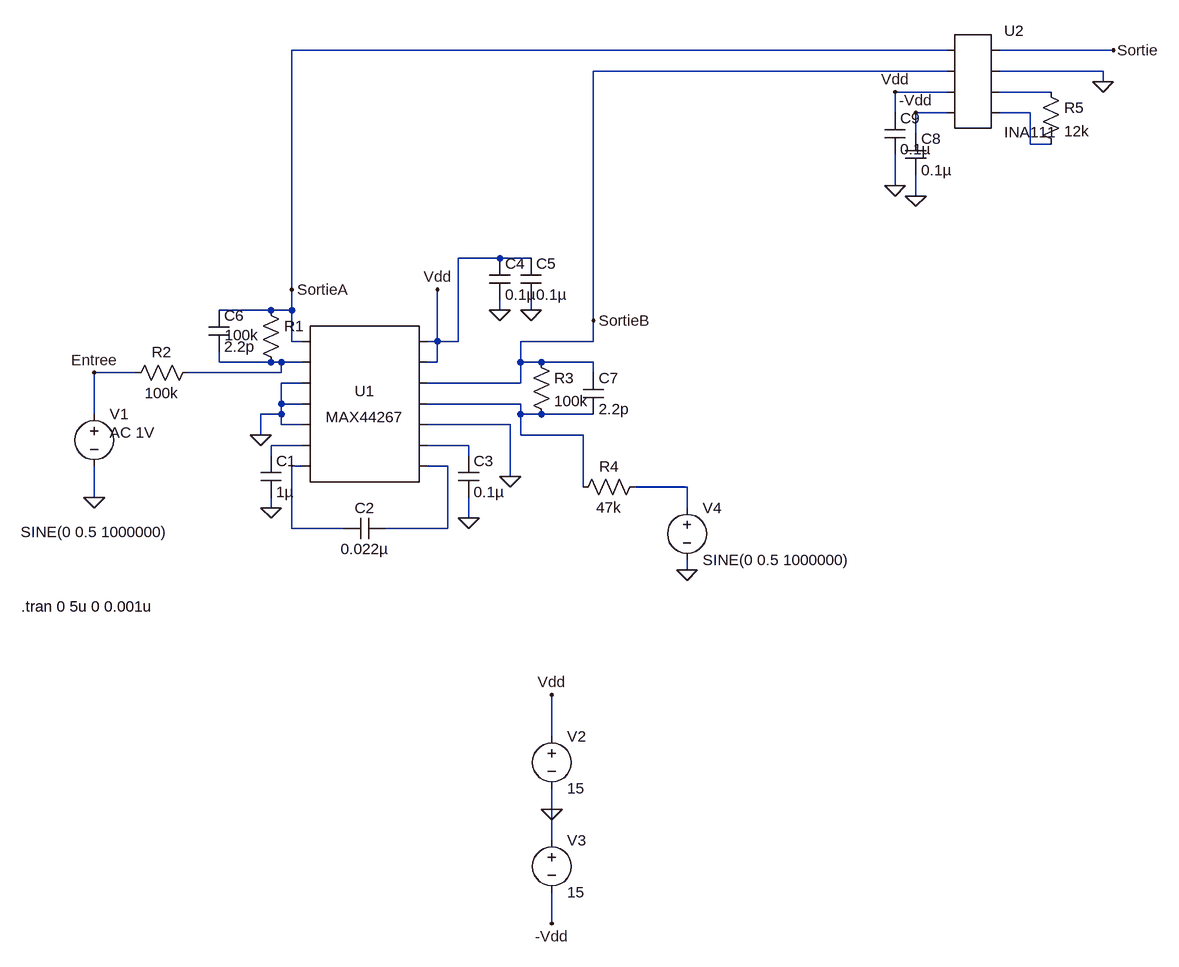
[diagram p0: schematic Chain d'acquisition.asc]
Chain d'acquisition.asc, the LTspice schematic file:
Version 4
SHEET 1 880 1332
WIRE -1456 -112 -2464 -112
WIRE -1200 -112 -1376 -112
WIRE -1456 -80 -2000 -80
WIRE -1216 -80 -1376 -80
WIRE -1216 -64 -1216 -80
WIRE -1456 -48 -1536 -48
WIRE -1296 -48 -1376 -48
WIRE -1536 -16 -1536 -48
WIRE -1456 -16 -1504 -16
WIRE -1328 -16 -1376 -16
WIRE -1504 16 -1504 -16
WIRE -1328 32 -1328 -16
WIRE -1296 32 -1328 32
WIRE -1536 96 -1536 48
WIRE -1504 112 -1504 80
WIRE -2144 208 -2208 208
WIRE -2096 208 -2144 208
WIRE -2464 256 -2464 -112
WIRE -2496 288 -2576 288
WIRE -2464 288 -2464 256
WIRE -2464 288 -2496 288
WIRE -2144 288 -2144 272
WIRE -2096 288 -2096 272
WIRE -2000 304 -2000 -80
WIRE -2464 336 -2464 288
WIRE -2448 336 -2464 336
WIRE -2240 336 -2240 256
WIRE -2240 336 -2256 336
WIRE -2208 336 -2208 208
WIRE -2208 336 -2240 336
WIRE -2000 336 -2000 304
WIRE -2000 336 -2112 336
WIRE -2576 368 -2576 352
WIRE -2496 368 -2576 368
WIRE -2480 368 -2496 368
WIRE -2448 368 -2480 368
WIRE -2240 368 -2240 336
WIRE -2240 368 -2256 368
WIRE -2112 368 -2112 336
WIRE -2080 368 -2112 368
WIRE -2000 368 -2080 368
WIRE -2704 384 -2768 384
WIRE -2480 384 -2480 368
WIRE -2480 384 -2624 384
WIRE -2000 384 -2000 368
WIRE -2448 400 -2480 400
WIRE -2112 400 -2112 368
WIRE -2112 400 -2256 400
WIRE -2480 432 -2480 400
WIRE -2448 432 -2480 432
WIRE -2112 432 -2256 432
WIRE -2768 448 -2768 384
WIRE -2480 448 -2480 432
WIRE -2480 448 -2512 448
WIRE -2112 448 -2112 432
WIRE -2080 448 -2112 448
WIRE -2000 448 -2080 448
WIRE -2480 464 -2480 448
WIRE -2448 464 -2480 464
WIRE -2128 464 -2256 464
WIRE -2512 480 -2512 448
WIRE -2112 480 -2112 448
WIRE -2016 480 -2112 480
WIRE -2448 496 -2496 496
WIRE -2192 496 -2256 496
WIRE -2496 512 -2496 496
WIRE -2192 512 -2192 496
WIRE -2448 528 -2464 528
WIRE -2224 528 -2256 528
WIRE -2128 544 -2128 464
WIRE -2016 560 -2016 480
WIRE -1856 560 -1936 560
WIRE -2768 576 -2768 528
WIRE -2496 592 -2496 576
WIRE -1856 592 -1856 560
WIRE -2192 608 -2192 576
WIRE -2464 624 -2464 528
WIRE -2384 624 -2464 624
WIRE -2224 624 -2224 528
WIRE -2224 624 -2320 624
WIRE -1856 688 -1856 672
WIRE -2064 944 -2064 880
WIRE -2064 1056 -2064 1024
WIRE -2064 1104 -2064 1056
WIRE -2064 1232 -2064 1184
FLAG -2512 480 0
FLAG -2496 592 0
FLAG -2192 608 0
FLAG -2144 288 0
FLAG -2096 288 0
FLAG -2464 256 SortieA
FLAG -2064 1056 0
FLAG -2064 880 Vdd
FLAG -2064 1232 -Vdd
FLAG -2240 256 Vdd
FLAG -2768 576 0
FLAG -2768 384 Entree
FLAG -2128 544 0
FLAG -2000 304 SortieB
FLAG -1856 688 0
FLAG -1216 -64 0
FLAG -1200 -112 Sortie
FLAG -1504 112 0
FLAG -1536 96 0
FLAG -1536 -48 Vdd
FLAG -1504 -16 -Vdd
SYMBOL AutoGenerated\\MAX44267 -2352 432 R0
SYMATTR InstName U1
SYMBOL cap -2512 512 R0
SYMATTR InstName C1
SYMATTR Value 1µ
SYMBOL cap -2320 608 R90
WINDOW 0 0 32 VBottom 2
WINDOW 3 32 32 VTop 2
SYMATTR InstName C2
SYMATTR Value 0.022µ
SYMBOL cap -2208 512 R0
SYMATTR InstName C3
SYMATTR Value 0.1µ
SYMBOL cap -2160 208 R0
SYMATTR InstName C4
SYMATTR Value 0.1µ
SYMBOL cap -2112 208 R0
SYMATTR InstName C5
SYMATTR Value 0.1µ
SYMBOL res -2512 272 R0
WINDOW 3 -55 54 Left 2
SYMATTR Value 100k
SYMATTR InstName R1
SYMBOL voltage -2064 928 R0
WINDOW 123 0 0 Left 0
WINDOW 39 0 0 Left 0
SYMATTR InstName V2
SYMATTR Value 15
SYMBOL voltage -2064 1088 R0
WINDOW 123 0 0 Left 0
WINDOW 39 0 0 Left 0
SYMATTR InstName V3
SYMATTR Value 15
SYMBOL res -2608 368 R90
WINDOW 0 0 56 VBottom 2
WINDOW 3 32 56 VTop 2
SYMATTR InstName R2
SYMATTR Value 100k
SYMBOL voltage -2768 432 R0
WINDOW 3 -113 197 Left 2
WINDOW 123 24 44 Left 2
WINDOW 39 0 0 Left 0
SYMATTR Value SINE(0 0.5 1000000)
SYMATTR Value2 AC 1V
SYMATTR InstName V1
SYMBOL cap -2592 288 R0
SYMATTR InstName C6
SYMATTR Value 2.2p
SYMBOL res -2096 352 R0
SYMATTR InstName R3
SYMATTR Value 100k
SYMBOL cap -2016 384 R0
SYMATTR InstName C7
SYMATTR Value 2.2p
SYMBOL voltage -1856 576 R0
WINDOW 123 0 0 Left 0
WINDOW 39 0 0 Left 0
SYMATTR InstName V4
SYMATTR Value SINE(0 0.5 1000000)
SYMBOL res -1920 544 R90
WINDOW 0 0 56 VBottom 2
WINDOW 3 32 56 VTop 2
SYMATTR InstName R4
SYMATTR Value 47k
SYMBOL AutoGenerated\\INA111 -1424 -64 R0
SYMATTR InstName U2
SYMBOL cap -1520 16 R0
SYMATTR InstName C8
SYMATTR Value 0.1µ
SYMBOL cap -1552 -16 R0
SYMATTR InstName C9
SYMATTR Value 0.1µ
SYMBOL res -1312 -64 R0
SYMATTR InstName R5
SYMATTR Value 12k
TEXT -2880 744 Left 2 !.tran 0 5u 0 0.001u

The netlist it stands for:
* Chain d'acquisition.asc
* U1: MAX44267 (symbol AutoGenerated\MAX44267 not available, pins judged from their places): pin1=SortieA pin2=N003 pin3=0 pin4=0 pin5=0 pin6=N005 pin7=N007 pin8=Vdd pin9=Vdd pin10=SortieB pin11=N004 pin12=0 pin13=N006 pin14=N008
C1 N005 0 1µ
C2 N008 N007 0.022µ
C3 N006 0 0.1µ
C4 Vdd 0 0.1µ
C5 Vdd 0 0.1µ
R1 SortieA N003 100k
V2 Vdd 0 15
V3 0 -Vdd 15
R2 N003 Entree 100k
V1 Entree 0 SINE(0 0.5 1000000) AC 1V
C6 SortieA N003 2.2p
R3 SortieB N004 100k
C7 SortieB N004 2.2p
V4 N009 0 SINE(0 0.5 1000000)
R4 N009 N004 47k
* U2: INA111 (symbol AutoGenerated\INA111 not available, pins judged from their places): pin1=SortieA pin2=SortieB pin3=Vdd pin4=-Vdd pin5=Sortie pin6=0 pin7=N001 pin8=N002
C8 -Vdd 0 0.1µ
C9 Vdd 0 0.1µ
R5 N001 N002 12k
.tran 0 5u 0 0.001u
.backanno
.end